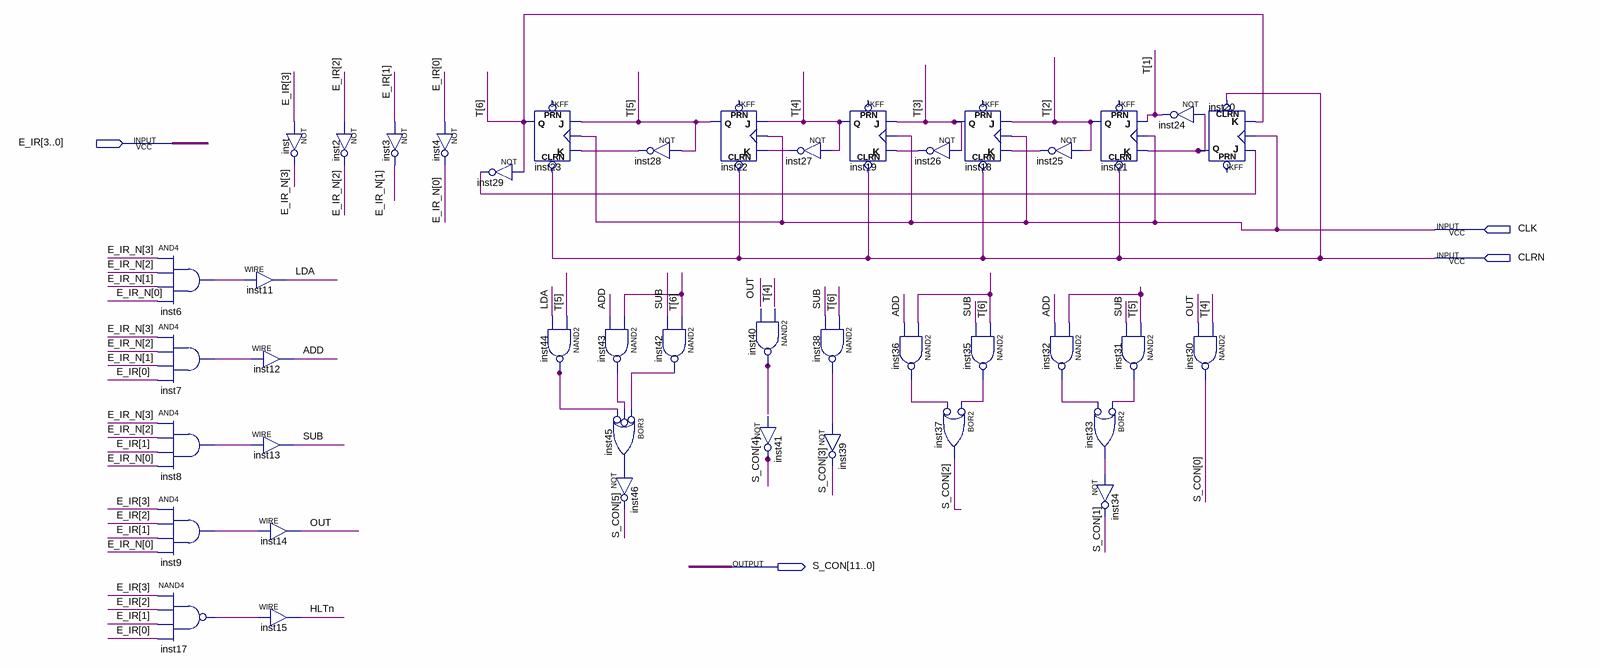
[diagram p0: schematic sheet]
// Quartus schematic Controlador_Senquenc.bdf as structural Verilog: 43 symbols, 4 pins
module Controlador_Senquenc (
  input  [3:0] E_IR,
  input  CLK,
  input  CLRN,
  output [11:0] S_CON
);

  wire ADD, HLTn, inst6_out, inst7_out, inst8_out, inst9_out, inst17_out, inst20_q, inst25_out, inst26_out,
       inst27_out, inst28_out, inst29_out, inst31_out, inst32_out, inst33_out, inst35_out, inst36_out,
       inst38_out, inst40_out, inst42_out, inst43_out, inst44_out, inst45_out, LDA, OUT, SUB, undriven;
  wire [3:0] E_IR_N;
  wire [6:1] T;

  and inst6 (inst6_out, E_IR_N[3], E_IR_N[2], E_IR_N[1], E_IR_N[0]);
  and inst7 (inst7_out, E_IR_N[3], E_IR_N[2], E_IR_N[1], E_IR[0]);
  and inst8 (inst8_out, E_IR_N[3], E_IR_N[2], E_IR[1], E_IR_N[0]);
  and inst9 (inst9_out, E_IR[3], E_IR[2], E_IR[1], E_IR_N[0]);
  nand inst17 (inst17_out, E_IR[3], E_IR[2], E_IR[1], E_IR[0]);
  not inst (E_IR_N[3], E_IR[3]);
  assign LDA = inst6_out;  // WIRE inst11
  assign ADD = inst7_out;  // WIRE inst12
  assign SUB = inst8_out;  // WIRE inst13
  assign OUT = inst9_out;  // WIRE inst14
  assign HLTn = inst17_out;  // WIRE inst15
  not inst2 (E_IR_N[2], E_IR[2]);
  not inst3 (E_IR_N[1], E_IR[1]);
  not inst4 (E_IR_N[0], E_IR[0]);
  not inst29 (inst29_out, T[6]);
  JKFF inst23 (.CLRN(CLRN), .K(inst28_out), .J(T[5]), .CLK(CLK), .Q(T[6]));  // open: PRN
  nand inst44 (inst44_out, T[5], LDA);
  nand inst43 (inst43_out, T[6], ADD);
  or inst45 (inst45_out, ~inst42_out, ~inst43_out, ~inst44_out);  // BOR3
  not inst46 (S_CON[5], inst45_out);
  not inst28 (inst28_out, T[5]);
  nand inst42 (inst42_out, T[6], SUB);
  JKFF inst22 (.CLRN(CLRN), .K(inst27_out), .J(T[4]), .CLK(CLK), .Q(T[5]));  // open: PRN
  // NAND2 inst40 has open pins: IN1=open, IN2=open, OUT=inst40_out
  not inst27 (inst27_out, T[4]);
  not inst41 (S_CON[4], undriven);
  JKFF inst19 (.CLRN(CLRN), .K(inst26_out), .J(T[3]), .CLK(CLK), .Q(T[4]));  // open: PRN
  nand inst38 (inst38_out, T[6], SUB);
  not inst39 (S_CON[3], inst38_out);
  not inst26 (inst26_out, T[3]);
  nand inst36 (inst36_out, T[6], ADD);
  JKFF inst18 (.CLRN(CLRN), .K(inst25_out), .J(T[2]), .CLK(CLK), .Q(T[3]));  // open: PRN
  nand inst35 (inst35_out, T[6], SUB);
  or inst37 (S_CON[2], ~inst35_out, ~inst36_out);  // BOR2
  JKFF inst21 (.CLRN(CLRN), .K(inst20_q), .J(T[1]), .CLK(CLK), .Q(T[2]));  // open: PRN
  not inst25 (inst25_out, T[2]);
  nand inst32 (inst32_out, T[5], ADD);
  or inst33 (inst33_out, ~inst31_out, ~inst32_out);  // BOR2
  not inst34 (S_CON[1], inst33_out);
  nand inst31 (inst31_out, T[5], SUB);
  JKFF inst20 (.CLRN(CLRN), .K(T[6]), .J(inst29_out), .CLK(CLK), .Q(inst20_q));  // open: PRN
  not inst24 (T[1], inst20_q);
  nand inst30 (S_CON[0], T[4], OUT);
endmodule
